# Altium schematic sheet TXpreamp.SchDoc: Title
size 420 x 297 mm; CheckedBy: -; CompanyName: CERN; DrawnBy: DrawnBy; Organization: CERN; Address1: European Organization for Nuclear Research; Address2: CH-1211 Genčve 23 - Switzerland; DocumentNumber: 7; Revision: -; SheetNumber: 7; SheetTotal: 10; EDA_Number: EDA-XXXXX-VX-X; Projet: -; ModifiedBy: -; CreateDate: XX/XX/XXXX; CheckedDate: -; Title2: Title2; DivGrp: TE/MPE; Designer: Designer; ModifiedDate: -
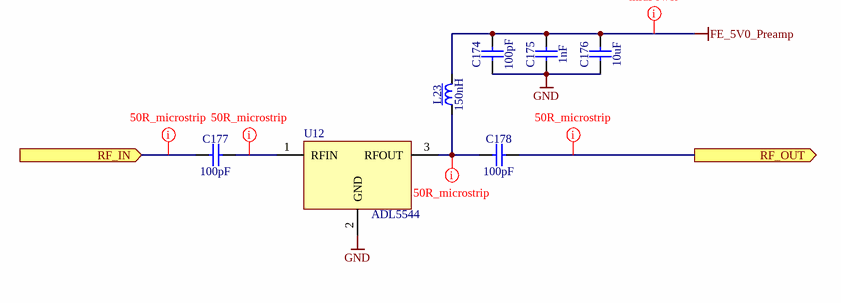
[diagram p0: TXpreamp.SchDoc]

## Parts
C174  100pF  [CAPC1005X55N]
C175  1nF  [CAPC1005X55N]
C176  10uF  [CAPC3216X180N]
C177  100pF  [CAPC1005X55N]
C178  100pF  [CAPC1005X55N]
L23  150nH  [IND_COILCRAFT_0805CS]
U12  ADL5544  [ADL5544]

## Ports
RF_IN (in), RF_OUT (out)

## Nets
FE_5V0_Preamp: C174.2 C175.2 C176.2 L23.2
GND: C174.1 C175.1 C176.1 U12.2(GND)
RF_IN: C177.1 ; port RF_IN
RF_OUT: C178.2 ; port RF_OUT
NetC177_2: C177.2 U12.1(RFIN)
NetC178_1: C178.1 L23.1 U12.3(RFOUT)

## Layout directives
net class midPower: FE_5V0_Preamp
net class 50R_class: NetC177_2, RF_IN, RF_OUT
net class 50R_class; rule Clearance Constraint [Generic clearance = 0.15mm, and 26 value(s) for objects]: NetC178_1

## Notes on the sheet
- Project/Equipment
- Document
- Designer
- Drawn by
- Check.by
- File
- Last Mod.
- Print Date
- Sheet
- Size
- A3
- of
- Rev

## Library data of the parts
C174 C177 C178 = CC0402_100PF_50V_5%_C0G: Non-polarised capacitor; Part Description: SMD Multilayer Chip Ceramic Capacitor; Manufacturer: GENERIC; Manufacturer1 Part Number: C0402C101J5GACTU; Voltage: 50V; TC: C0G/NP0; Tolerance: ±5%; Part Number: CC0402_100PF_50V_5%_C0G; Component Kind: Standard; Component Type: Standard; Pin Count: 2; Value: 100pF; Status: Preferred; Manufacturer Part Number: CC0402_100PF_50V_5%_C0G; Case: 0402; Mounted: Yes; Socket: No; SMD: Yes; Sense: No; Manufacturer1 Example: KEMET; Manufacturer1 ComponentHeight: 0.55mm; HelpURL: \\cern.ch\dfs\Applications\Altium\Datasheets\CC0805_C0G_KEMET_(Commercial Grade).pdf; Author: CERN DEM JLC; CreateDate: 03.12.2007; LatestRevisionDate: 22.04.2015
C175 = CC0402_1NF_50V_10%_X7R: Non-polarised capacitor; Part Description: SMD Multilayer Chip Ceramic Capacitor; Manufacturer: GENERIC; Manufacturer1 Part Number: 223858715623; Voltage: 50V; TC: X7R; Tolerance: ±10%; Part Number: CC0402_1NF_50V_10%_X7R; Component Kind: Standard; Component Type: Standard; Pin Count: 2; Value: 1nF; Status: Not Recommended; Manufacturer Part Number: CC0402_1NF_50V_10%_X7R; Case: 0402; Mounted: Yes; Socket: No; SMD: Yes; Sense: No; Manufacturer1 Example: PHYCOMP; Manufacturer1 ComponentHeight: 0.55mm; HelpURL: \\cern.ch\dfs\Applications\Altium\Datasheets\CC0402_X7R_PHYCOMP.pdf; Author: CERN DEM JLC; CreateDate: 03.12.2007; LatestRevisionDate: 03.12.2007
C176 = CC1206_10UF_25V_10%_X7R: Non-polarised capacitor; Part Description: SMD Multilayer Chip Ceramic Capacitor; Manufacturer: GENERIC; Manufacturer1 Part Number: C1206C106K4RACTU; Voltage: 25V; TC: X7R; Tolerance: ±10%; Part Number: CC1206_10UF_25V_10%_X7R; Component Kind: Standard; Component Type: Standard; Pin Count: 2; Value: 10uF; Status: Preferred; Manufacturer Part Number: CC1206_10uF_25V_10%_X7R; Case: 1206; Mounted: Yes; Socket: No; SMD: Yes; Sense: No; Manufacturer1 Example: KEMET; Manufacturer1 ComponentHeight: 1.8mm; HelpURL: \\cern.ch\dfs\Applications\Altium\Datasheets\CC1206_X7R_KEMET.pdf; Author: CERN DEM JLC; CreateDate: 12.09.2012; LatestRevisionDate: 12.09.2012
L23 = IND_150NH_2%_COILCRAFT_0805CS: Inductor With Core; Part Description: SMT Chip Inductor; Manufacturer Part Number: 0805CS-151XGLC; Power: 400mA; Resistance: 0.56R; Tolerance: ±2%; Part Number: IND_150NH_2%_COILCRAFT_0805CS; Component Kind: Standard; Component Type: Standard; Pin Count: 2; Value: 150nH; Status: None; Manufacturer: COILCRAFT; Case: 0805; Mounted: Yes; Socket: No; SMD: Yes; Sense: No; ComponentHeight: 1.52mm; HelpURL: \\cern.ch\dfs\Applications\Altium\Datasheets\IND_COILCRAFT_0805CS.pdf; Author: CERN DEM JLC; CreateDate: 03.03.2015; LatestRevisionDate: 03.03.2015